# EAGLE design StepperBoard (EAGLE 8.0.0)
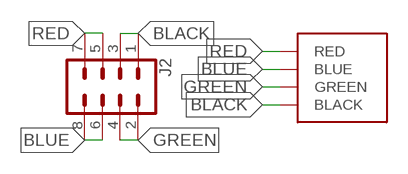
[diagram p0: schematic, sheet 1]

## Parts
J2  CONN_04X2  [2X4]
U$1  STEPPERW_HOLES  [STEPPER_ONBOARD]

## Nets
BLACK: J2.1 J2.3 U$1.BLACK
BLUE: J2.6 J2.8 U$1.BLUE
GREEN: J2.2 J2.4 U$1.GREEN
RED: J2.5 J2.7 U$1.RED

## Library data of the parts
J2 = SparkFun-Connectors:CONN_04X2: Multi connection point. Often used as Generic Header-pin footprint for 0.1 inch spaced/style header connections On any of the 0.1 inch spaced packages, you can populate with these: Break Away Headers - Straight <https://www.sparkfun.com/products/116> (PRT-00116) Break Away Male Headers - Right Angle <https://www.sparkfun.com/products/553> (PRT-00553) Female Headers <https://www.sparkfun.com/products/115> (PRT-00115) Break Away Headers - Machine Pin <https://www.sparkfun.com/products/117> (PRT-00117) Break Away Female Headers - Swiss Machine Pin <https://www.sparkfun.com/products/743> (PRT-00743)
U$1 = Richard:STEPPER

## Board
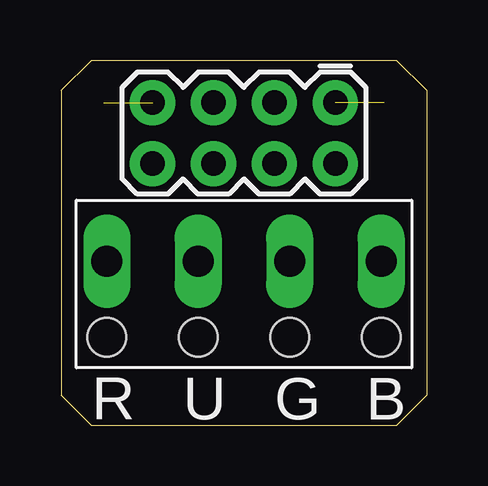
[diagram p1: board, top side]
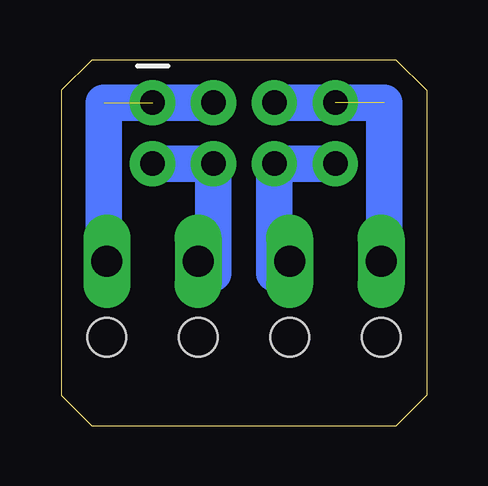
[diagram p2: board, bottom side, seen from below]

Size 15.24 x 15.24 mm. Coordinates in mm from the lower left corner, seen from the top.
Outline: 0,13.97 0,1.27 1.27,0 13.97,0 15.24,1.27 15.24,13.97 13.97,15.24 1.27,15.24 0,13.97
Copper layers (1*16): Top 0.035mm / dielectric 1.5mm / Bottom 0.035mm
Design rules "default": minimum track width 10mil, minimum drill 24mil, track to track 8mil, track to pad 8mil, pad to pad 8mil, via to via 8mil, smd to smd 8mil, copper to edge 40mil, drill to drill 8mil, minimum pad ring 10mil, minimum via ring 8mil, stop-mask expansion 4mil, vias tented up to drill 0mil, thermal gap 10mil

### Footprints (pad centres in the part's own frame; a part is rotated, then mirrored left to right if it is on the bottom)
2X4 = drill 1.016 pad 1.88: 1 -3.81,-1.27; 2 -3.81,1.27; 3 -1.27,-1.27; 4 -1.27,1.27; 5 1.27,-1.27; 6 1.27,1.27; 7 3.81,-1.27; 8 3.81,1.27
STEPPER_ONBOARD = drill 1.3 long: BLACK -5.715,0; BLUE 1.905,0; GREEN -1.905,0; RED 5.715,0 | hole 1.6: -5.715,3.175; -1.905,3.175; 1.905,3.175; 5.715,3.175

### Placement (x,y rotation side)
J2  7.62,12.19 180 top
U$1  7.62,6.86 180 top

### Tracks (layer width: path | path; a pad name or v marks a point on that pad's centre or on a via)
BLACK  (1 unrouted)
  Bottom 1.524: U$1.BLACK 13.46,6.35 13.46,13.46 J2.3
BLUE
  Bottom 1.524: U$1.BLUE 6.35,6.35 J2.6 J2.8
GREEN
  Bottom 1.524: U$1.GREEN 8.89,6.35 J2.4 J2.2
RED  (1 unrouted)
  Bottom 1.524: J2.5 1.78,13.46 1.78,6.35 U$1.RED

### Text on the board
tPlace: R | U | G | B